# Altium schematic sheet XH-3A_C29086011_XH-3A_C2908601.schdoc.schdoc
size 124 x 101 mm
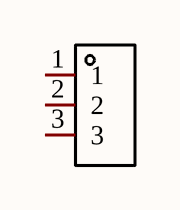
[diagram p0: XH-3A_C29086011_XH-3A_C2908601.schdoc.schdoc]

## Parts
CN?  XH-3A  [CONN-TH_XH-3A]  (value not drawn)

## Nets

Not connected (* = marked no-connect by the designer): CN? 1 2 3

## Library data of the parts
CN? = XH-3A: Manufacturer: HCTL(华灿天禄); Symbol: XH-3A_C2908601; Add into BOM: yes; Pins Structure: 1x3P; Pitch: 2.5mm; Number of PINs Per Row: 3; Reference Series: XH; Current Rating (Max): 3A; Device: XH-3A; Supplier: LCSC; Supplier Part: C2908601; Manufacturer Part: XH-3A; JLCPCB Part Class: Extended Part; LCSC Part Name: 1x3P 间距:2.5mm 直插 系列:XH; Supplier Footprint: 插件,P=2.5mm; Datasheet: https://atta.szlcsc.com/upload/public/pdf/source/20230711/68D365716984B4AFE576D1D73D61B465.pdf; Convert to PCB: yes; Mounting Style: 直插; Row Spacing: -; Number of Pins: 3P; Number of Rows: 1; Operating Temperature Range: -25℃~+85℃